# EAGLE schematic window-sensor (EAGLE 8.2.1)

## Sheet 1 of 4: device
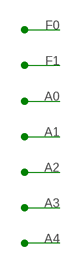
[diagram p0: schematic, sheet 1]

## Sheet 2 of 4: microcontroller
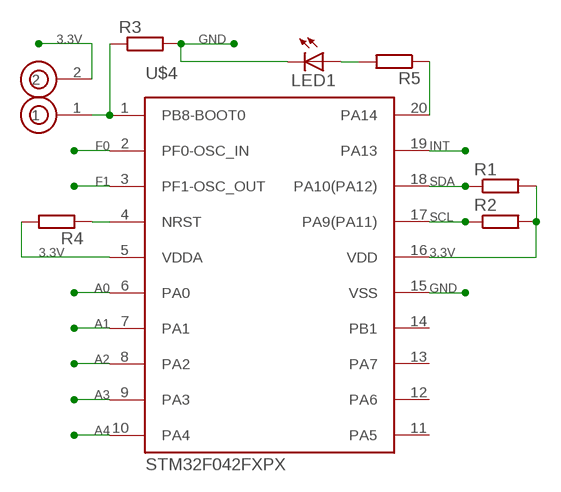
[diagram p1: schematic, sheet 2]

### Parts
LED1  LEDSML1206  [SML1206]
R1  R-EU_R1206  [R1206]
R2  R-EU_R0603  [R0603]
R3  R-EU_R1206  [R1206]
R4  R-EU_R0603  [R0603]
R5  R-EU_R0603  [R0603]
U$3  GOLDPIN_2  [GOLDPIN_2_SMD]
U$4  STM32F042FXPX  [TSSOP20]

### Nets
3.3V: R1.2 R2.2 R4.2 U$3.2 U$4.5(VDDA) U$4.16(VDD) ; also sheet 3
A0: U$4.6(PA0) ; also sheet 1
A1: U$4.7(PA1) ; also sheet 1
A2: U$4.8(PA2) ; also sheet 1
A3: U$4.9(PA3) ; also sheet 1
A4: U$4.10(PA4) ; also sheet 1
BOOT: R3.1 U$3.1 U$4.1(PB8-BOOT0)
F0: U$4.2(PF0-OSC_IN) ; also sheet 1
F1: U$4.3(PF1-OSC_OUT) ; also sheet 1
GND: LED1.C R3.2 U$4.15(VSS) ; also sheet 3,4
INT: U$4.19(PA13) ; also sheet 4
N$1: R5.1 U$4.20(PA14)
N$2: LED1.A R5.2
RST: R4.1 U$4.4(NRST)
SCL: R2.1 U$4.17(PA9(PA11)) ; also sheet 4
SDA: R1.1 U$4.18(PA10(PA12)) ; also sheet 4
Unconnected: U$4.11(PA5) U$4.12(PA6) U$4.13(PA7) U$4.14(PB1)

## Sheet 3 of 4: power source
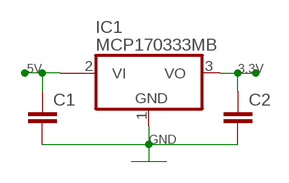
[diagram p2: schematic, sheet 3]

### Parts
C1  C-EUC1206  [C1206]
C2  C-EUC1206  [C1206]
IC1  MCP170333MB  [SOT89]

### Nets
3.3V: C2.1 IC1.3(VO) ; also sheet 2
5V: C1.1 IC1.2@1(VI1) ; also sheet 4
GND: C1.2 C2.2 IC1.1(GND) ; also sheet 2,4
Unconnected: IC1.2(VI)

## Sheet 4 of 4: port
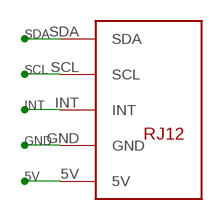
[diagram p3: schematic, sheet 4]

### Parts
U$2  RJ12SMD  [RJ12_SMD]

### Nets
5V: U$2.5V ; also sheet 3
GND: U$2.GND ; also sheet 2,3
INT: U$2.INT ; also sheet 2
SCL: U$2.SCL ; also sheet 2
SDA: U$2.SDA ; also sheet 2

## Library data of the parts
C1 C2 = rcl:C-EU: CAPACITOR, European symbol
IC1 = linear:MCP1703*: 250 mA, 16V, Low Quiescent Current LDO Regulator Source: http://ww1.microchip.com/downloads/en/DeviceDoc/22049b.pdf
LED1 = led:LED: LED OSRAM: - CHIPLED LG R971, LG N971, LY N971, LG Q971, LY Q971, LO R971, LY R971 LH N974, LH R974 LS Q976, LO Q976, LY Q976 LO Q996 - Hyper CHIPLED LW Q18S LB Q993, LB Q99A, LB R99A - SideLED LS A670, LO A670, LY A670, LG A670, LP A670 LB A673, LV A673, LT A673, LW A673 LH A674 LY A675 LS A676, LA A676, LO A676, LY A676, LW A676 LS A679, LY A679, LG A679 - Hyper Micro SIDELED® LS Y876, LA Y876, LO Y876, LY Y876 LT Y87S - SmartLED LW L88C, LW L88S LB L89C, LB L89S, LG L890 LS L89K, LO L89K, LY L89K LS L896, LA L896, LO L896, LY L896 - TOPLED LS T670, LO T670, LY T670, LG T670, LP T670 LSG T670, LSP T670, LSY T670, LOP T670, LYG T670 LG T671, LOG T671, LSG T671 LB T673, LV T673, LT T673, LW T673 LH T674 LS T676, LA T676, LO T676, LY T676, LB T676, LH T676, LSB T676, LW T676 LB T67C, LV T67C, LT T67C, LS T67K, LO T67K, LY T67K, LW E67C LS E67B, LA E67B, LO E67B, LY E67B, LB E67C, LV E67C, LT E67C LW T67C LS T679, LY T679, LG T679 LS T770, LO T770, LY T770, LG T770, LP T770 LB T773, LV T773, LT T773, LW T773 LH T774 LS E675, LA E675, LY E675, LS T675 LS T776, LA T776, LO T776, LY T776, LB T776 LHGB T686 LT T68C, LB T68C - Hyper Mini TOPLED® LB M676 - Mini TOPLED Santana® LG M470 LS M47K, LO M47K, LY M47K Source: http://www.osram.convergy.de LUXEON: - LUMILED® LXK2-PW12-R00, LXK2-PW12-S00, LXK2-PW14-U00, LXK2-PW14-V00 LXK2-PM12-R00, LXK2-PM12-S00, LXK2-PM14-U00 LXK2-PE12-Q00, LXK2-PE12-R00, LXK2-PE12-S00, LXK2-PE14-T00, LXK2-PE14-U00 LXK2-PB12-K00, LXK2-PB12-L00, LXK2-PB12-M00, LXK2-PB14-N00, LXK2-PB14-P00, LXK2-PB14-Q00 LXK2-PR12-L00, LXK2-PR12-M00, LXK2-PR14-Q00, LXK2-PR14-R00 LXK2-PD12-Q00, LXK2-PD12-R00, LXK2-PD12-S00 LXK2-PH12-R00, LXK2-PH12-S00 LXK2-PL12-P00, LXK2-PL12-Q00, LXK2-PL12-R00 Source: www.luxeon.com KINGBRIGHT: KA-3528ASYC Source: www.kingbright.com
R1-R5 = resistor:R-EU_: RESISTOR, European symbol
U$2 = gumyns:RJ12
U$3 = gumyns:GOLDPIN_2
U$4 = stm32f0:STM32F042FXPX